# EAGLE design high_start (EAGLE 7.6.0)
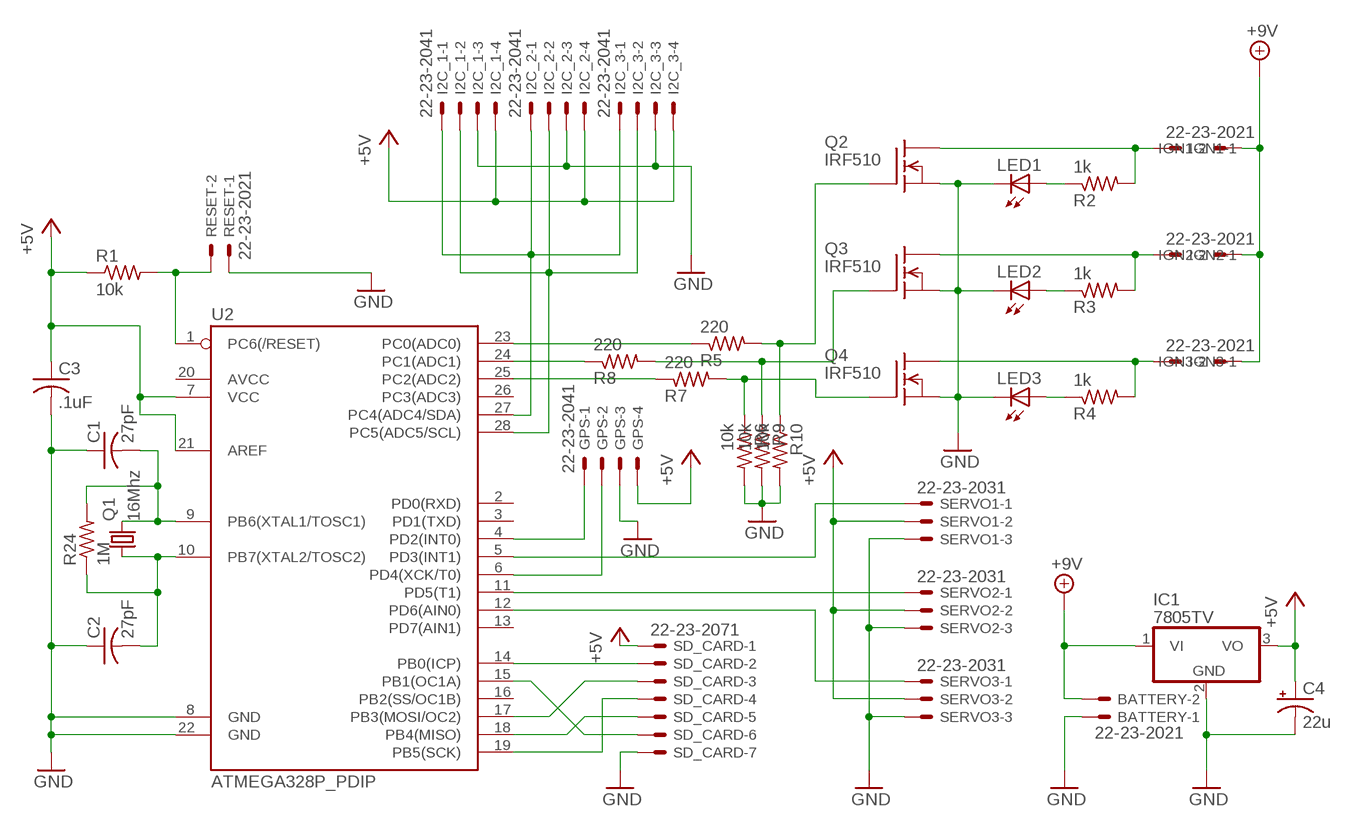
[diagram p0: schematic, sheet 1]

## Parts
BATTERY  22-23-2021  [22-23-2021]
C1  27pF  C-US025-040X050  [C025-040X050]
C2  27pF  C-US025-040X050  [C025-040X050]
C3  .1uF  C-US025-030X050  [C025-030X050]
C4  22u  CPOL-USB45181A  [B45181A]
GPS  22-23-2041  [22-23-2041]
I2C_1  22-23-2041  [22-23-2041]
I2C_2  22-23-2041  [22-23-2041]
I2C_3  22-23-2041  [22-23-2041]
IC1  7805TV  [TO220V]
IGN1  22-23-2021  [22-23-2021]
IGN2  22-23-2021  [22-23-2021]
IGN3  22-23-2021  [22-23-2021]
LED1  LED5MM  [LED5MM]
LED2  LED5MM  [LED5MM]
LED3  LED5MM  [LED5MM]
Q1  16Mhz  CRYSTALHC49S  [HC49/S]
Q2  IRF510  [TO220]
Q3  IRF510  [TO220]
Q4  IRF510  [TO220]
R1  10k  R-US_0207/7  [0207/7]
R2  1k  R-US_0207/7  [0207/7]
R3  1k  R-US_0207/7  [0207/7]
R4  1k  R-US_0207/7  [0207/7]
R5  220  R-US_0207/7  [0207/7]
R6  10k  R-US_0207/5V  [0207/5V]
R7  220  R-US_0207/7  [0207/7]
R8  220  R-US_0207/7  [0207/7]
R9  10k  R-US_0207/5V  [0207/5V]
R10  10k  R-US_0207/5V  [0207/5V]
R24  1M  R-US_0207/7  [0207/7]
RESET  22-23-2021  [22-23-2021]
SD_CARD  22-23-2071  [22-23-2071]
SERVO1  22-23-2031  [22-23-2031]
SERVO2  22-23-2031  [22-23-2031]
SERVO3  22-23-2031  [22-23-2031]
U2  ATMEGA328P_PDIP  [DIL28-3]

## Nets
+5V: C3.1 C4.+ GPS.4 I2C_1.4 I2C_2.4 I2C_3.4 IC1.3(VO) R1.1 SD_CARD.1 SERVO1.2 SERVO2.2 SERVO3.2 U2.7(VCC) U2.21(AREF)
+9V: BATTERY.2 IC1.1(VI) IGN1.2 IGN2.2 IGN3.2
GND: BATTERY.1 C1.1 C2.1 C3.2 C4.- GPS.3 I2C_1.3 I2C_2.3 I2C_3.3 IC1.2(GND) LED1.K(C) LED2.K(C) LED3.K(C) Q2.3(S) Q3.3(S) Q4.3(S) R6.2 R9.2 R10.2 RESET.1 SD_CARD.7 SERVO1.3 SERVO2.3 SERVO3.3 U2.8(GND) U2.22(GND)
N$1: I2C_1.2 I2C_2.2 I2C_3.2 U2.28(PC5(ADC5/SCL))
N$2: I2C_1.1 I2C_2.1 I2C_3.1 U2.27(PC4(ADC4/SDA))
N$3: GPS.1 U2.4(PD2(INT0))
N$4: C1.2 Q1.2 R24.2 U2.9(PB6(XTAL1/TOSC1))
N$5: C2.2 Q1.1 R24.1 U2.10(PB7(XTAL2/TOSC2))
N$6: GPS.2 U2.6(PD4(XCK/T0))
N$7: SD_CARD.2 U2.14(PB0(ICP))
N$8: SD_CARD.3 U2.17(PB3(MOSI/OC2))
N$9: SD_CARD.4 U2.19(PB5(SCK))
N$10: SD_CARD.5 U2.18(PB4(MISO))
N$11: SD_CARD.6 U2.15(PB1(OC1A))
N$12: IGN1.1 Q2.2(D) R2.2
N$13: IGN2.1 Q3.2(D) R3.2
N$14: IGN3.1 Q4.2(D) R4.2
N$15: SERVO1.1 U2.5(PD3(INT1))
N$16: SERVO2.1 U2.11(PD5(T1))
N$17: SERVO3.1 U2.12(PD6(AIN0))
N$18: Q2.1(G) R5.2 R10.1
N$19: Q3.1(G) R8.2 R9.1
N$20: Q4.1(G) R6.1 R7.2
N$21: LED1.A R2.1
N$22: LED2.A R3.1
N$23: LED3.A R4.1
N$24: R5.1 U2.23(PC0(ADC0))
N$25: R7.1 U2.25(PC2(ADC2))
N$26: R8.1 U2.24(PC1(ADC1))
N$43: R1.2 RESET.2 U2.1(PC6(/RESET))
Unconnected: U2.2(PD0(RXD)) U2.3(PD1(TXD)) U2.13(PD7(AIN1)) U2.16(PB2(SS/OC1B)) U2.20(AVCC) U2.26(PC3(ADC3))

## Library data of the parts
BATTERY IGN1-IGN3 RESET = con-molex:22-23-2021: .100" (2.54mm) Center Header - 2 Pin; MF: MOLEX; MPN: 22-23-2021; OC_FARNELL: 1462926; OC_NEWARK: 25C3832
C1-C3 = rcl:C-US: CAPACITOR, American symbol
C4 = rcl:CPOL-US: POLARIZED CAPACITOR, American symbol
GPS I2C_1-I2C_3 = con-molex:22-23-2041: .100" (2.54mm) Center Header - 4 Pin; MF: MOLEX; MPN: 22-23-2041; OC_FARNELL: 1462920; OC_NEWARK: 38C0355
IC1 = linear:78*: Positive VOLTAGE REGULATOR Source: http://cache.national.com/ds/LM/LM78L05.pdf http://www.fairchildsemi.com/ds/LM/LM7805.pdf
LED1-LED3 = led:LED: LED OSRAM: - CHIPLED LG R971, LG N971, LY N971, LG Q971, LY Q971, LO R971, LY R971 LH N974, LH R974 LS Q976, LO Q976, LY Q976 LO Q996 - Hyper CHIPLED LW Q18S LB Q993, LB Q99A, LB R99A - SideLED LS A670, LO A670, LY A670, LG A670, LP A670 LB A673, LV A673, LT A673, LW A673 LH A674 LY A675 LS A676, LA A676, LO A676, LY A676, LW A676 LS A679, LY A679, LG A679 - Hyper Micro SIDELED® LS Y876, LA Y876, LO Y876, LY Y876 LT Y87S - SmartLED LW L88C, LW L88S LB L89C, LB L89S, LG L890 LS L89K, LO L89K, LY L89K LS L896, LA L896, LO L896, LY L896 - TOPLED LS T670, LO T670, LY T670, LG T670, LP T670 LSG T670, LSP T670, LSY T670, LOP T670, LYG T670 LG T671, LOG T671, LSG T671 LB T673, LV T673, LT T673, LW T673 LH T674 LS T676, LA T676, LO T676, LY T676, LB T676, LH T676, LSB T676, LW T676 LB T67C, LV T67C, LT T67C, LS T67K, LO T67K, LY T67K, LW E67C LS E67B, LA E67B, LO E67B, LY E67B, LB E67C, LV E67C, LT E67C LW T67C LS T679, LY T679, LG T679 LS T770, LO T770, LY T770, LG T770, LP T770 LB T773, LV T773, LT T773, LW T773 LH T774 LS E675, LA E675, LY E675, LS T675 LS T776, LA T776, LO T776, LY T776, LB T776 LHGB T686 LT T68C, LB T68C - Hyper Mini TOPLED® LB M676 - Mini TOPLED Santana® LG M470 LS M47K, LO M47K, LY M47K Source: http://www.osram.convergy.de LUXEON: - LUMILED® LXK2-PW12-R00, LXK2-PW12-S00, LXK2-PW14-U00, LXK2-PW14-V00 LXK2-PM12-R00, LXK2-PM12-S00, LXK2-PM14-U00 LXK2-PE12-Q00, LXK2-PE12-R00, LXK2-PE12-S00, LXK2-PE14-T00, LXK2-PE14-U00 LXK2-PB12-K00, LXK2-PB12-L00, LXK2-PB12-M00, LXK2-PB14-N00, LXK2-PB14-P00, LXK2-PB14-Q00 LXK2-PR12-L00, LXK2-PR12-M00, LXK2-PR14-Q00, LXK2-PR14-R00 LXK2-PD12-Q00, LXK2-PD12-R00, LXK2-PD12-S00 LXK2-PH12-R00, LXK2-PH12-S00 LXK2-PL12-P00, LXK2-PL12-Q00, LXK2-PL12-R00 Source: www.luxeon.com KINGBRIGHT: KA-3528ASYC Source: www.kingbright.com
Q1 = crystal:CRYSTAL: CRYSTAL; OC_FARNELL: 1667008; OC_NEWARK: unknown
Q2-Q4 = transistor-fet:IRF510: N-Channel Enhancement MOSFET (HEXFET); 100V; 5,6A; 0,54Ohm
R1-R10 R24 = rcl:R-US_: RESISTOR, American symbol
SD_CARD = con-molex:22-23-2071: .100" (2.54mm) Center Header - 7 Pin; MF: MOLEX; MPN: 22-23-2071; OC_FARNELL: 1654534; OC_NEWARK: 56H0445
SERVO1-SERVO3 = con-molex:22-23-2031: .100" (2.54mm) Center Header - 3 Pin; MF: MOLEX; MPN: 22-23-2031; OC_FARNELL: 1462950; OC_NEWARK: 30C0862
U2 = SparkFun-DigitalIC:ATMEGA328P_PDIP: uC used in the Arduino 32kb flash, 1k EEPROM, 2k SRAM This is the through-hole version of this chip.

## Net classes
1 GND: width 1.016 mm, drill 1.016 mm, clearance 0.508 mm

## Board
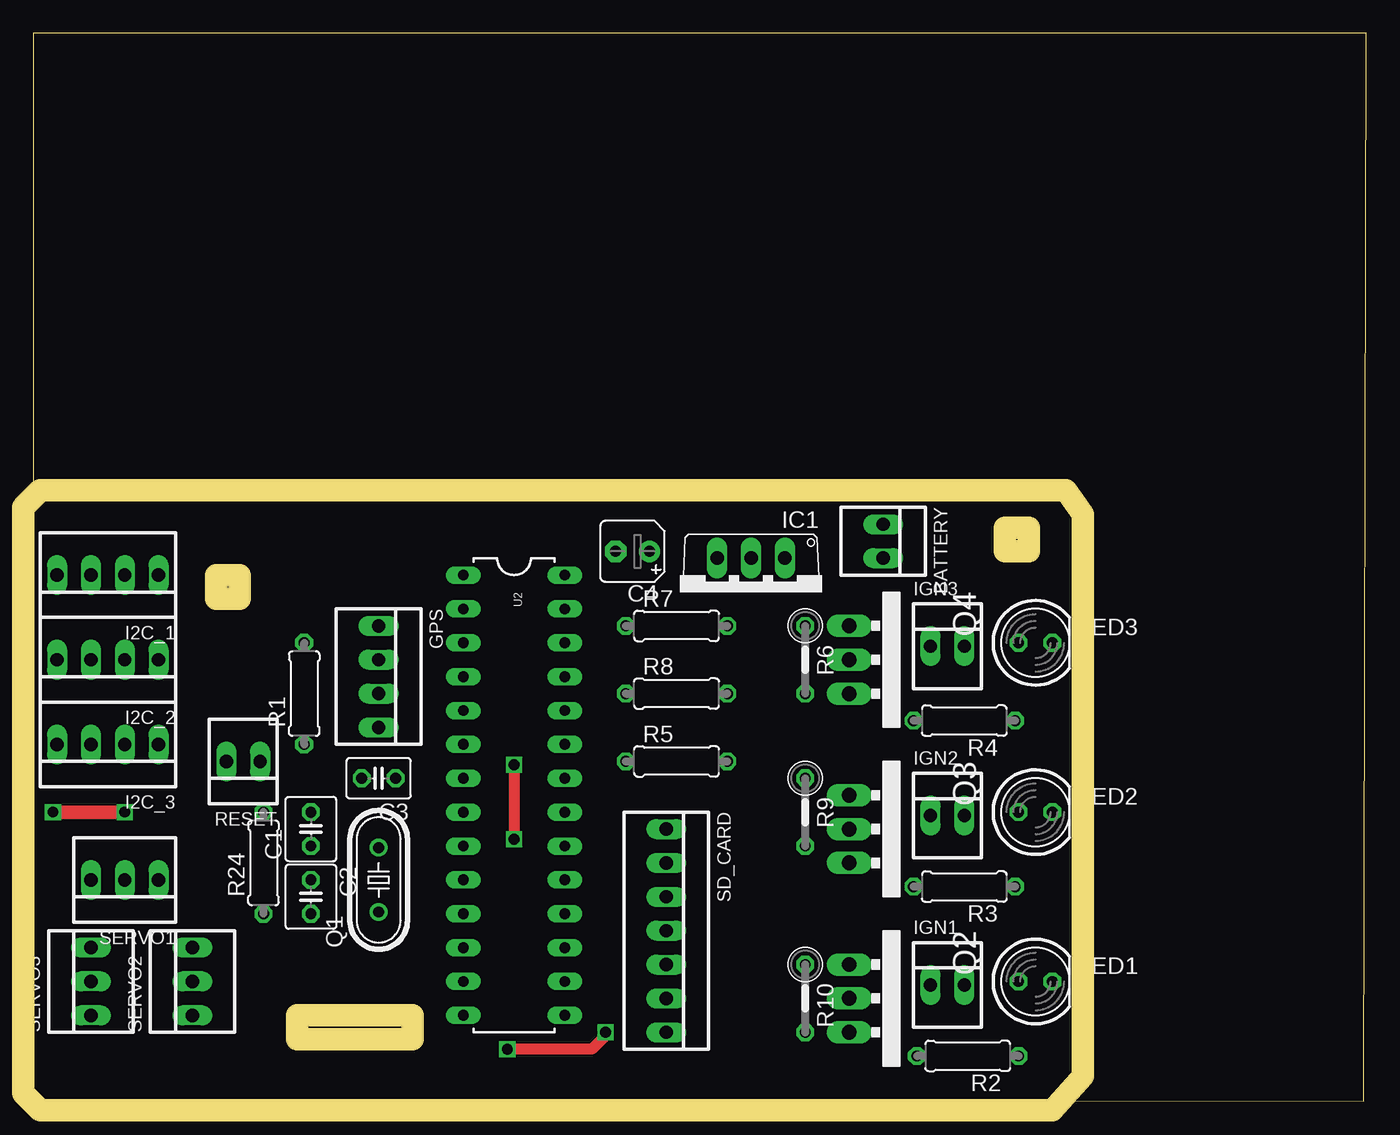
[diagram p1: board, top side]
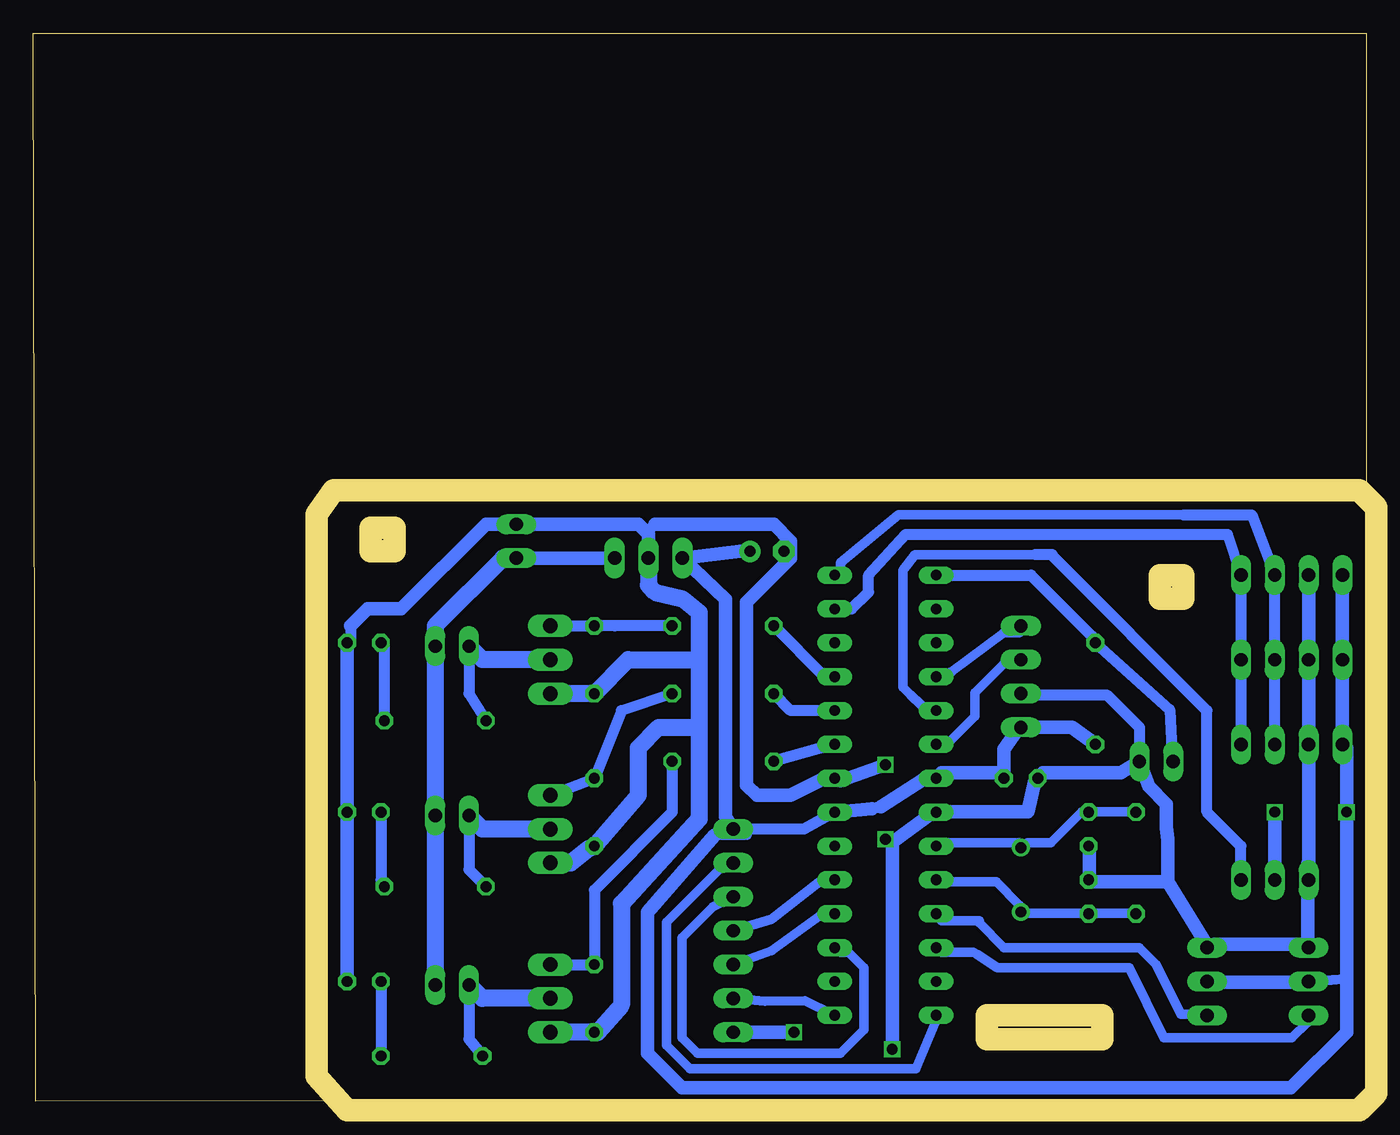
[diagram p2: board, bottom side, seen from below]

Size 100 x 80.08 mm. Coordinates in mm from the lower left corner, seen from the top.
Outline: 0,0.08 99.82,0 100,80.08 0,80.08 0,0.08
Copper layers (1*16): Top 0.035mm / dielectric 1.5mm / Bottom 0.035mm
Design rules "default *": minimum track width 28mil, minimum drill 31mil, track to track 18mil, track to pad 18mil, pad to pad 18mil, via to via 18mil, smd to smd 8mil, copper to edge 0mil, drill to drill 18mil, minimum pad ring 10mil, minimum via ring 8mil, stop-mask expansion 4mil, vias tented up to drill 0mil, thermal gap 10mil
Milling: 20 lines

### Footprints (pad centres in the part's own frame; a part is rotated, then mirrored left to right if it is on the bottom)
22-23-2021 = drill 1 long: 1 -1.27,0; 2 1.27,0
C025-040X050 = drill 0.813 octagon: 1 -1.27,0; 2 1.27,0
C025-030X050 = drill 0.813 octagon: 1 -1.27,0; 2 1.27,0
B45181A = drill 0.813 pad 1.6: + -1.27,0 | drill 0.813 pad 1.6 octagon: - 1.27,0
22-23-2041 = drill 1 long: 1 -3.81,0; 2 -1.27,0; 3 1.27,0; 4 3.81,0
TO220V = drill 1.016 long: 1 -2.54,-2.54; 2 0,-2.54; 3 2.54,-2.54
LED5MM = drill 0.813 octagon: A -1.27,0; K 1.27,0
HC49/S = drill 0.813: 1 -2.413,0; 2 2.413,0
TO220 = drill 1.118 long: 1 -2.54,-6.35; 2 0,-6.35; 3 2.54,-6.35
0207/7 = drill 0.813 octagon: 1 -3.81,0; 2 3.81,0
0207/5V = drill 0.813 octagon: 1 -2.54,0; 2 2.54,0
22-23-2071 = drill 1 long: 1 -7.62,0; 2 -5.08,0; 3 -2.54,0; 4 0,0; 5 2.54,0; 6 5.08,0; 7 7.62,0
22-23-2031 = drill 1 long: 1 -2.54,0; 2 0,0; 3 2.54,0
DIL28-3 = drill 0.813 long: 1 -16.51,-3.81; 2 -13.97,-3.81; 3 -11.43,-3.81; 4 -8.89,-3.81; 5 -6.35,-3.81; 6 -3.81,-3.81; 7 -1.27,-3.81; 8 1.27,-3.81; 9 3.81,-3.81; 10 6.35,-3.81; 11 8.89,-3.81; 12 11.43,-3.81; 13 13.97,-3.81; 14 16.51,-3.81; 15 16.51,3.81; 16 13.97,3.81; 17 11.43,3.81; 18 8.89,3.81; 19 6.35,3.81; 20 3.81,3.81; 21 1.27,3.81; 22 -1.27,3.81; 23 -3.81,3.81; 24 -6.35,3.81; 25 -8.89,3.81; 26 -11.43,3.81; 27 -13.97,3.81; 28 -16.51,3.81

### Placement (x,y rotation side)
BATTERY  63.75,41.99 270 top
C1  20.83,20.4 90 top
C2  20.83,15.32 270 top
C3  25.91,24.21 180 top
C4  44.96,41.22 180 top
GPS  25.91,31.83 270 top
I2C_1  5.59,39.45 180 top
I2C_2  5.59,33.1 180 top
I2C_3  5.59,26.75 180 top
IC1  53.85,38.18 180 top
IGN1  68.58,8.71 0 top
IGN2  68.58,21.41 0 top
IGN3  68.58,34.11 0 top
LED1  75.18,8.97 0 top
LED2  75.18,21.67 0 top
LED3  75.18,34.37 0 top
Q1  25.91,16.59 90 top
Q2  67.56,7.7 270 top
Q3  67.56,20.4 270 top
Q4  67.56,33.1 270 top
R1  20.32,30.56 90 top
R2  70.1,3.38 180 top
R3  69.85,16.08 180 top
R4  69.85,28.52 180 top
R5  48.26,25.48 0 top
R6  57.91,33.1 270 top
R7  48.26,35.64 0 top
R8  48.26,30.56 0 top
R9  57.91,21.67 270 top
R10  57.91,7.7 270 top
R24  17.27,17.86 90 top
RESET  15.75,25.48 180 top
SD_CARD  47.5,12.78 270 top
SERVO1  6.86,16.59 180 top
SERVO2  11.94,8.97 90 top
SERVO3  4.32,8.97 90 top
U2  36.07,22.94 270 top

### Tracks (layer width: path | path; a pad name or v marks a point on that pad's centre or on a via)
+5V  (via drill 0.8)
  Top 1.016: v6.86,21.67 v1.47,21.67
  Bottom 0.711: 26.01,28.04 GPS.4 | 31.85,24.61 U2.7 32.44,24.1 33.27,24.1 | 27.18,24.61 C3.1 | 47.73,20.75 47.73,20.52 SD_CARD.1 46.46,19.94 48.9,19.94 | 4.9,8.92 SERVO3.2 | 11.91,8.92 SERVO2.2 | SERVO3.2 4.06,8.92 1.45,9.17 SERVO3.2
  Bottom 0.813: 1.47,26.44 I2C_3.4 | 36.42,22.07 37.08,21.92 | U2.21 42.16,20.4 SD_CARD.1
  Bottom 1.016: 26.01,28.04 27.18,26.37 27.18,24.61 31.85,24.61 | 47.73,20.75 48.06,21.34 48.06,37.62 IC1.3 46.99,41.22 C4.+ | 11.91,8.92 4.9,8.92 | 48.9,19.94 53.92,14.15 53.92,3.58 51.33,0.99 5.64,0.99 1.47,5.16 1.47,7.67 1.45,9.17 1.47,11.18 v1.47,21.67 1.47,26.44 | R1.1 22.1,28.02 GPS.4 | I2C_1.4 I2C_2.4 I2C_3.4 | SERVO1.2 v6.86,21.67 | 33.27,24.1 36.42,22.07 | 37.08,21.92 U2.21
+9V
  Bottom 1.016: IC1.1 BATTERY.2
  Bottom 1.27: BATTERY.2 64.77,40.72 69.85,35.64 IGN3.2 IGN2.2 IGN1.2
GND  (via drill 0.8)
  Top 0.813: v42.93,5.16 42.93,4.9 41.91,3.89 v35.56,3.89 | v36.07,25.22 v36.07,19.63
  Bottom 0.711: 20.75,17.02 C2.1 20.75,16.43 | 20.75,18.77 C1.1 | 4.39,11.76 SERVO3.3 | 11.4,11.76 SERVO2.3 11.99,11.76 | 32.44,21.69 U2.8 31.85,21.69 | 24.26,24.61 C3.2 24.84,24.03 | 24.84,30.45 25.43,30.45 GPS.3 | 39.45,24.03 U2.22
  Bottom 0.813: 35.56,19.41 35.56,19.13 v36.07,19.63 | 24.84,30.45 19.46,30.45 17.02,28.02 RESET.1 | 4.39,17.78 SERVO1.3 | 60.96,5.16 Q2.3 | 76.2,35.64 76.2,34.62 LED3.K | R10.2 57.66,5.16 | IC1.2 53.85,42.75 53.34,43.26 | 43.18,40.72 C4.-
  Bottom 1.016: 20.75,18.77 20.75,17.02 | 11.4,11.76 4.39,11.76 4.39,17.78 | 14.88,16.43 20.75,16.43 | 11.99,11.76 14.88,16.43 | 35.56,19.41 32.44,21.69 | 24.26,24.61 18.41,24.61 RESET.1 16.31,23.6 14.99,22.28 14.99,20.52 14.88,19.61 14.88,16.43 | 31.85,21.69 25.4,21.69 24.84,24.03 | SD_CARD.7 v42.93,5.16 | v35.56,3.89 35.56,19.13 | I2C_1.3 I2C_2.3 I2C_3.3 SERVO1.3 | 39.45,24.03 v36.07,25.22 | 76.2,35.64 74.93,36.91 72.39,36.91 66.04,43.26 BATTERY.1 54.61,43.26 53.85,42.49 IC1.2 | LED3.K LED2.K LED1.K | 53.34,43.26 44.45,43.26 43.18,41.99 43.18,40.72 46.48,37.41 46.48,23.7 45.72,22.94 43.18,22.94 40.64,24.21 U2.22
  Bottom 1.27: IC1.2 53.85,38.68 53.34,38.18 51.31,37.67 50.04,36.65 50.04,33.1 | 50.04,33.1 50.04,28.02 | 50.04,28.02 50.04,21.16 55.88,14.81 55.88,7.19 57.66,5.16 | 50.04,33.1 55.37,33.1 R6.2 Q4.3 | 50.04,28.02 53.09,28.02 54.61,26.49 54.61,22.94 R9.2 58.42,18.87 59.69,17.86 Q3.3 | R10.2 Q2.3
N$1
  Bottom 0.711: 13.69,43.97 35.1,43.97 39.45,40.39 39.45,39.8 U2.28
  Bottom 0.813: 13.69,43.97 8.59,43.97 I2C_1.2 I2C_2.2 I2C_3.2
N$2
  Bottom 0.813: U2.27 38.61,36.91 37.34,38.18 37.34,39.45 34.54,42.49 10.41,42.49 I2C_1.1 I2C_2.1 I2C_3.1
N$3
  Bottom 0.711: U2.4 31.85,31.7 31.11,32.21 27.18,35.13 26.01,35.13 GPS.1
N$4
  Bottom 0.711: R24.2 17.25,21.69 20.75,21.69 C1.2 21.34,21.69 23.67,19.36 25.43,19.36 Q1.2 26.01,19.36 31.85,19.36 U2.9
N$5
  Bottom 0.711: R24.1 17.25,14.1 20.75,14.1 C2.2 21.34,14.1 25.43,14.1 Q1.1 26.01,14.68 27.76,16.43 31.85,16.43 U2.10
N$6
  Bottom 0.711: U2.6 31.85,26.95 31.27,26.95 29.36,28.85 29.36,30.61 27.18,32.79 26.01,32.79 GPS.2
N$7
  Bottom 0.711: U2.14 32.44,5.92 32.31,5.92 33.78,2.41 50.75,2.41 52.5,4.17 52.5,13.41 47.73,18.19 SD_CARD.2
N$8
  Bottom 0.711: U2.17 39.45,11.18 38.86,11.18 37.69,10.01 37.69,5.33 39.45,3.58 50.16,3.58 51.33,4.75 51.33,12.24 49,14.58 SD_CARD.3
N$9
  Bottom 0.711: U2.19 40.03,16.43 41.02,16.43 44.6,13.61 SD_CARD.4
N$10
  Bottom 0.711: U2.18 39.78,14.02 40.84,14.02 44.6,11.28 SD_CARD.5
N$11
  Bottom 0.711: U2.15 40.03,6.5 42.09,7.52 45.11,7.49 SD_CARD.6
N$12
  Bottom 0.813: IGN1.1 67.31,4.65 R2.2
  Bottom 1.27: Q2.2 66.29,7.7 IGN1.1
N$13
  Bottom 0.813: IGN2.1 67.31,17.35 R3.2
  Bottom 1.27: Q3.2 66.29,20.4 IGN2.1
N$14
  Bottom 0.813: IGN3.1 67.31,30.56 R4.2
  Bottom 1.27: Q4.2 66.29,33.1 IGN3.1
N$15
  Bottom 0.711: 24.84,40.97 33.86,40.97 34.77,39.8 34.77,31.04 34.19,30.45 33.35,29.69 32.44,29.29 U2.5
  Bottom 0.813: SERVO1.1 9.4,19.13 11.94,21.67 11.94,29.29 23.37,40.72 23.57,40.97 24.84,40.97
N$16
  Bottom 0.711: U2.11 31.85,13.51 29.03,13.51 29.03,13.36 27.18,11.51 17.02,11.51 15.75,10.24 13.89,6.5 11.99,6.5 SERVO2.1
N$17
  Bottom 0.711: U2.12 31.85,11.18 29.46,11.18 29.21,11 27.69,9.98 17.78,9.98 15.16,4.75 5.56,4.75 4.39,5.92 SERVO3.1
N$18
  Bottom 0.813: Q2.1 R10.1 57.91,15.82 52.07,21.67 R5.2
N$19
  Bottom 0.813: Q3.1 R9.1 55.88,29.29 R8.2
N$20
  Bottom 0.813: Q4.1 R6.1 | 56.39,35.64 R6.1 | R7.2 R6.1
N$21
  Bottom 0.813: LED1.A 73.91,3.63 R2.1
N$22
  Bottom 0.813: LED2.A 73.91,16.59 R3.1
N$23
  Bottom 0.813: R4.1 73.66,34.11 LED3.A
N$24
  Bottom 0.813: U2.23 R5.1
N$25
  Bottom 0.813: U2.25 40.64,31.83 R7.1
N$26
  Bottom 0.813: U2.24 43.18,29.29 R8.1
N$43
  Bottom 0.711: 14.53,25.6 RESET.2
  Bottom 0.813: U2.1 25.15,39.45 20.57,34.87 R1.2 14.73,29.36 14.53,25.6